# Altium project Eros_PCB.PrjPcb
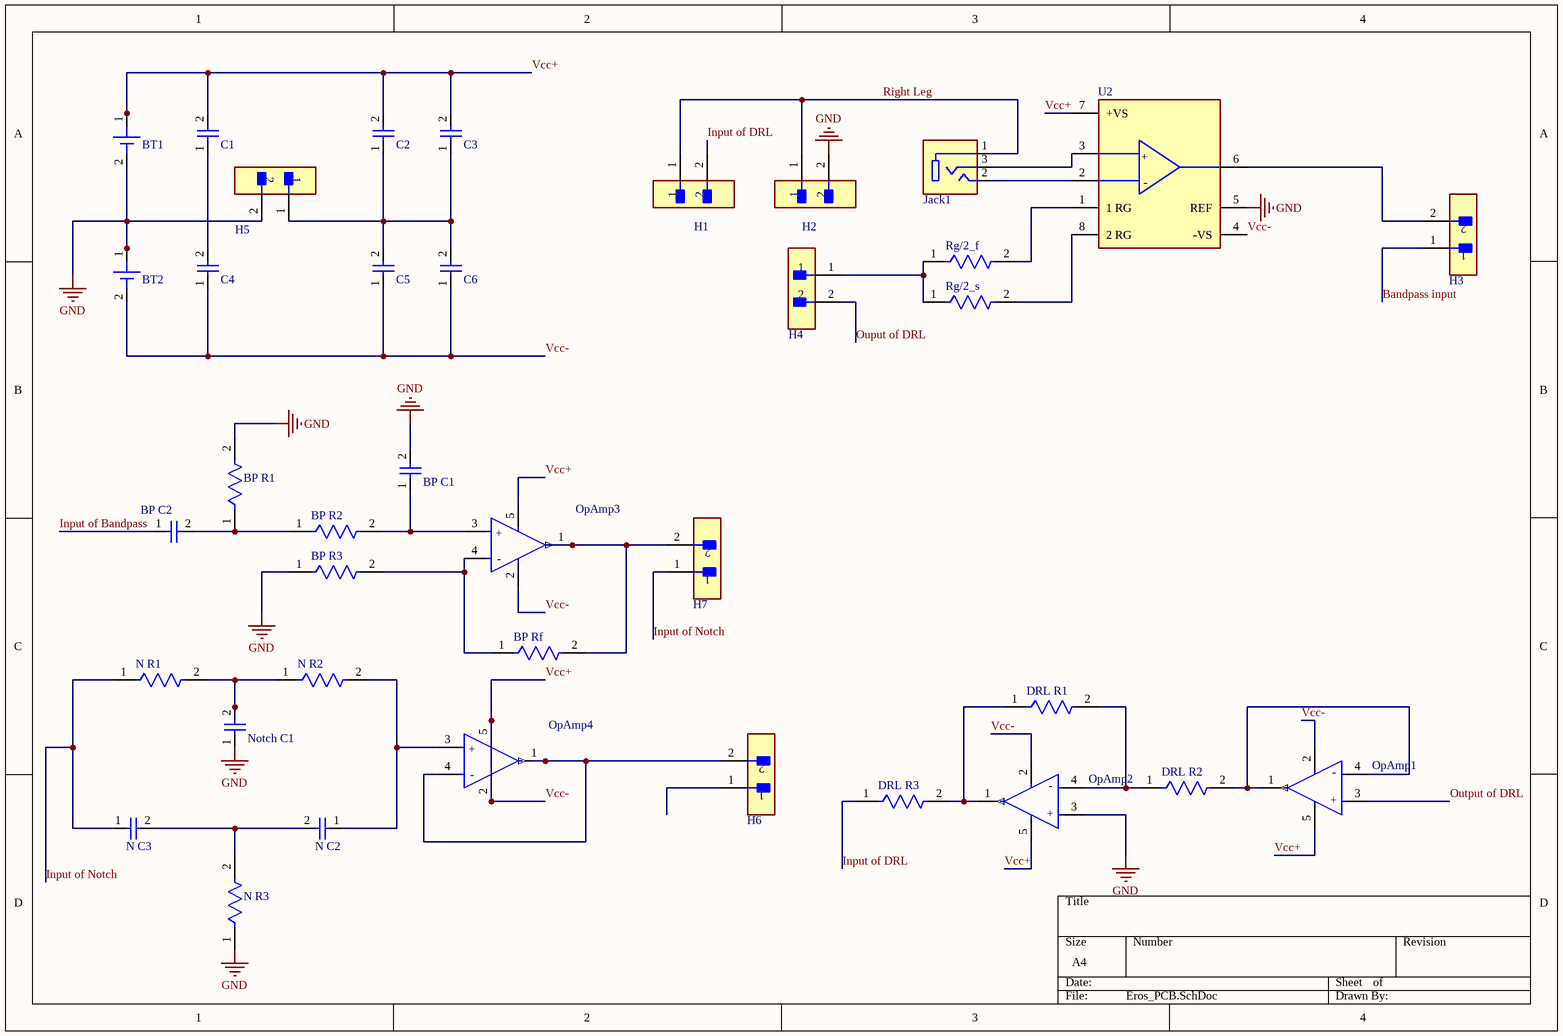
[diagram p0: Eros_PCB.SchDoc]
1 sheet, 38 parts. Net scope: global (net labels, ports and power ports of the same name join across sheets).
Board file: Eros_PCB.PcbDoc

## Sheet Eros_PCB.SchDoc
size A4; SheetNumber: 1; SheetTotal: 1

### Parts
BP_C1  08052U220GAT2A  [CAPC2013X115X51ML20T26]  (value not drawn)
BP_C2  08052U220GAT2A  [CAPC2013X115X51ML20T26]  (value not drawn)
BP_R1  CRCW08053K30FKEA  [FP-CRCW0805-e3-MFG]  (value not drawn)
BP_R2  CRCW08053K30FKEA  [FP-CRCW0805-e3-MFG]  (value not drawn)
BP_R3  CRCW08053K30FKEA  [FP-CRCW0805-e3-MFG]  (value not drawn)
BP_Rf  CRCW08053K30FKEA  [FP-CRCW0805-e3-MFG]  (value not drawn)
BT1  BK-913-TR  [BAT_BK-913-TR]  (value not drawn)
BT2  BK-913-TR  [BAT_BK-913-TR]  (value not drawn)
C1  08052U220GAT2A  [CAPC2013X115X51ML20T26]  (value not drawn)
C2  08052U220GAT2A  [CAPC2013X115X51ML20T26]  (value not drawn)
C3  08052U220GAT2A  [CAPC2013X115X51ML20T26]  (value not drawn)
C4  08052U220GAT2A  [CAPC2013X115X51ML20T26]  (value not drawn)
C5  08052U220GAT2A  [CAPC2013X115X51ML20T26]  (value not drawn)
C6  08052U220GAT2A  [CAPC2013X115X51ML20T26]  (value not drawn)
DRL_R1  CRCW08053K30FKEA  [FP-CRCW0805-e3-MFG]  (value not drawn)
DRL_R2  CRCW08053K30FKEA  [FP-CRCW0805-e3-MFG]  (value not drawn)
DRL_R3  CRCW08053K30FKEA  [FP-CRCW0805-e3-MFG]  (value not drawn)
H1  TSW-102-07-L-S  [FP-TSW-102-07-L-S-MFG]  (value not drawn)
H2  TSW-102-07-L-S  [FP-TSW-102-07-L-S-MFG]  (value not drawn)
H3  TSW-102-07-L-S  [FP-TSW-102-07-L-S-MFG]  (value not drawn)
H4  TSW-102-07-L-S  [FP-TSW-102-07-L-S-MFG]  (value not drawn)
H5  TSW-102-07-L-S  [FP-TSW-102-07-L-S-MFG]  (value not drawn)
H6  TSW-102-07-L-S  [FP-TSW-102-07-L-S-MFG]  (value not drawn)
H7  TSW-102-07-L-S  [FP-TSW-102-07-L-S-MFG]  (value not drawn)
Jack1  SJ-3523-SMT-TR  [CUI_SJ-3523-SMT-TR]  (value not drawn)
N_C2  08052U220GAT2A  [CAPC2013X115X51ML20T26]  (value not drawn)
N_C3  08052U220GAT2A  [CAPC2013X115X51ML20T26]  (value not drawn)
N_R1  CRCW08053K30FKEA  [FP-CRCW0805-e3-MFG]  (value not drawn)
N_R2  CRCW08053K30FKEA  [FP-CRCW0805-e3-MFG]  (value not drawn)
N_R3  CRCW08053K30FKEA  [FP-CRCW0805-e3-MFG]  (value not drawn)
Notch_C1  08052U220GAT2A  [CAPC2013X115X51ML20T26]  (value not drawn)
OpAmp1  TLV521DCKT  [FP-DCK0005A-IPC_C]  (value not drawn)
OpAmp2  TLV521DCKT  [FP-DCK0005A-IPC_C]  (value not drawn)
OpAmp3  TLV521DCKT  [FP-DCK0005A-IPC_C]  (value not drawn)
OpAmp4  TLV521DCKT  [FP-DCK0005A-IPC_C]  (value not drawn)
Rg/2_f  CRCW08053K30FKEA  [FP-CRCW0805-e3-MFG]  (value not drawn)
Rg/2_s  CRCW08053K30FKEA  [FP-CRCW0805-e3-MFG]  (value not drawn)
U2  AD620ARZ-REEL7  [FP-R-8-IPC_A]  (value not drawn)

### Nets
GND: BP_C1.2 BP_R1.2 BP_R3.1 BT1.2(NEG) BT2.1(POS) H2.2 H5.2 N_R3.1 Notch_C1.1 OpAmp2.3(IN+) U2.5(REF)
Bandpass input: H3.1
Input of Bandpass: BP_C2.1
Input of DRL: DRL_R3.1 H1.2
Input of Notch: H7.1 N_C3.1 N_R1.1
Ouput of DRL: H4.2
Output of DRL: OpAmp1.3(IN+)
Right Leg: H1.1 H2.1 Jack1.1
Vcc+: BT1.1(POS) BT2.2(NEG) C1.2 C2.2 C3.2 C4.1 C5.1 C6.1 OpAmp1.2(V-) OpAmp1.5(V+) OpAmp2.2(V-) OpAmp2.5(V+) OpAmp3.2(V-) OpAmp3.5(V+) OpAmp4.2(V-) OpAmp4.5(V+) U2.4(-VS) U2.7(+VS)  [also labelled Vcc-]
NetBP_C1_1: BP_C1.1 BP_R2.2 OpAmp3.3(IN+)
NetBP_C2_2: BP_C2.2 BP_R1.1 BP_R2.1
NetBP_R3_2: BP_R3.2 BP_Rf.1 OpAmp3.4(IN-)
NetBP_Rf_2: BP_Rf.2 H7.2 OpAmp3.1(OUT)
NetC1_1: C1.1 C4.2
NetC2_1: C2.1 C3.1 C5.2 C6.2 H5.1
NetDRL_R1_1: DRL_R1.1 DRL_R3.2 OpAmp2.1(OUT)
NetDRL_R1_2: DRL_R1.2 DRL_R2.1 OpAmp2.4(IN-)
NetDRL_R2_2: DRL_R2.2 OpAmp1.1(OUT) OpAmp1.4(IN-)
NetH3_2: H3.2 U2.6(OUTPUT)
NetH4_1: H4.1 Rg/2_f.1 Rg/2_s.1
NetH6_2: H6.2 OpAmp4.1(OUT) OpAmp4.4(IN-)
NetJack1_2: Jack1.2 U2.2(-IN)
NetJack1_3: Jack1.3 U2.3(+IN)
NetN_C2_1: N_C2.1 N_R2.2 OpAmp4.3(IN+)
NetN_C2_2: N_C2.2 N_C3.2 N_R3.2
NetN_R1_2: N_R1.2 N_R2.1 Notch_C1.2
NetRg/2_f_2: Rg/2_f.2 U2.1(1_RG)
NetRg/2_s_2: Rg/2_s.2 U2.8(2_RG)

Not connected (* = marked no-connect by the designer): H6 1

### Notes on the sheet
- (in symbol CMP-04895-000072-1) -; +
- (in symbol CMP-09116-000354-1) +

### Library data of the parts
BP_C1 BP_C2 C1-C6 N_C2 N_C3 Notch_C1 = CMP-2007-04866-1: Manufacturer: AVX Interconnect / Elco; Part Number: 08052U220GAT2A
BP_R1-BP_R3 BP_Rf DRL_R1-DRL_R3 N_R1-N_R3 Rg/2_f Rg/2_s = CMP-2001-03876-2: RES Thick Film, 3.3kΩ, 1%, 0.125W, 100ppm/°C, 0805; Max Power Dissipation: 125mW; Resistance: 3.3kR; Voltage Rating: 150V; Package Quantity: 10; Height: 0.45mm; Case/Package: 0805; Length: 2mm; Mount: Surface Mount; Packaging: Tape and Reel; Features: Automotive AEC-Q200; Termination: SMD/SMT; Radiation Hardening: No; Case Code (Imperial): 0805; Weight: 0.000194oz; Min Operating Temperature: -55°C; Max Operating Temperature: 155°C; Composition: Thick Film; Case Code (Metric): 2012; Voltage Rating (DC): 150V; Lead Free: Lead Free; Temperature Coefficient: 100ppm/°C; Depth: 1.25mm; Number of Terminations: 2; Military Standard: Not; Contact Plating: Tin; Tolerance: 1%; Power Rating: 125mW; Width: 1.25mm
BT1 BT2 = BK-913-TR: Battery Retainer Coin, 20.0mm 1 Cell PC Pin; MF: MPD (Memory; MP: BK-913-TR; Package: MSOP-12 MPD; SnapEDA_Link: https://www.snapeda.com/parts/BK-913-TR/MPD%20(Memory%20Protection%20Devices)/view-part/576523/?ref=snap; Value: *; Digi-Key_Part_Number: BK-913-CT-ND
H1-H7 = CMP-02766-001428-1: CONN HEADER VERT 2POS 2.54MM; Voltage Rating: 550V; Current Rating: 7.6A; Gender: Male; Number of Contacts: 2; Connector Type: Male Pin; Radiation Hardening: No; Orientation: Straight; Contact Plating: Gold; Max Operating Temperature: 125°C; Mount: Through Hole; Package Quantity: 1; Number of Rows: 1; Housing Material: Polyester; RoHS Compliant: Yes; Length: 5.08mm; Max Voltage Rating (AC): 550V; Pitch: 2.54mm; Packaging: Bulk; Depth: 2.54mm; Termination: Solder; Min Operating Temperature: -55°C; Housing Color: Black; Lead Free: Lead Free; Color: Black; Number of Positions: 2; Width: 2.54mm; Max Current Rating: 7.6A; REACH SVHC: No SVHC; Contact Material: Bronze; Contact Mating Length: 0.23inch; Series: TSW; Contact Type: Male Pin
Jack1 = SJ-3523-SMT-TR: <b>Audio Jack Connector</b> 3.5 mm Low Profile Surface Mount Stereo Jack, 3 Pin Right-Angle; Package: None; MP: SJ-3523-SMT-TR; Value: *; Availability: Unavailable; Price: None
OpAmp1-OpAmp4 = CMP-04895-000072-1: IC CMOS 1 CIRCUIT SC70-5; Input Offset Voltage (Vos): 100uV; Output Current per Channel: 12mA; Number of Circuits: 1; Slew Rate: 2.5V/µs; Operating Supply Current: 350nA; Bandwidth: 6kHz; Input Bias Current: 1pA; Mount: Surface Mount; Case/Package: SC; REACH SVHC: No SVHC; Max Operating Temperature: 125°C; Lead Free: Lead Free; Packaging: Cut Tape; Min Operating Temperature: -40°C; Number of Amplifiers: 1; Gain Bandwidth Product: 6kHz; Number of Pins: 5; Number of Channels: 1
U2 = CMP-09116-000354-1: IC INST AMP 1 CIRCUIT 8SOIC; Input Resistance: 10GR; Bandwidth: 800kHz; Dual Supply Voltage: 15V; Number of Channels: 1; Power Dissipation: 650mW; Input Bias Current: 500pA; Common Mode Rejection Ratio: 93dB; Slew Rate: 1.2V/µs; Supply Current: 900uA; Input Offset Voltage (Vos): 30mV; Min Dual Supply Voltage: 2.3V; Min Supply Voltage: 4.6V; Power Supply Rejection Ratio (PSRR): 140dB; Operating Supply Voltage: 18V; Output Current per Channel: 18mA; -3db Bandwidth: 1MHz; Operating Supply Current: 1.3mA; Mount: Surface Mount; RoHS Compliant: Yes; Max Operating Temperature: 125°C; Radiation Hardening: No; Packaging: Tape and Reel; Nominal Supply Current: 900uA; Contact Plating: Tin; Number of Elements: 1; Number of Circuits: 1; Series: -; Case/Package: SOIC; Package Quantity: 1; Max Dual Supply Voltage: 18V; Min Operating Temperature: -55°C; Lead Free: Contains Lead; Number of Pins: 8; Max Power Dissipation: 650mW